# EasyEDA schematic Prática-10.json
TITLE: Sheet_1; REV: 1.0; Date: 2020-11-04; Sheet: 1/1; Company: Your Company
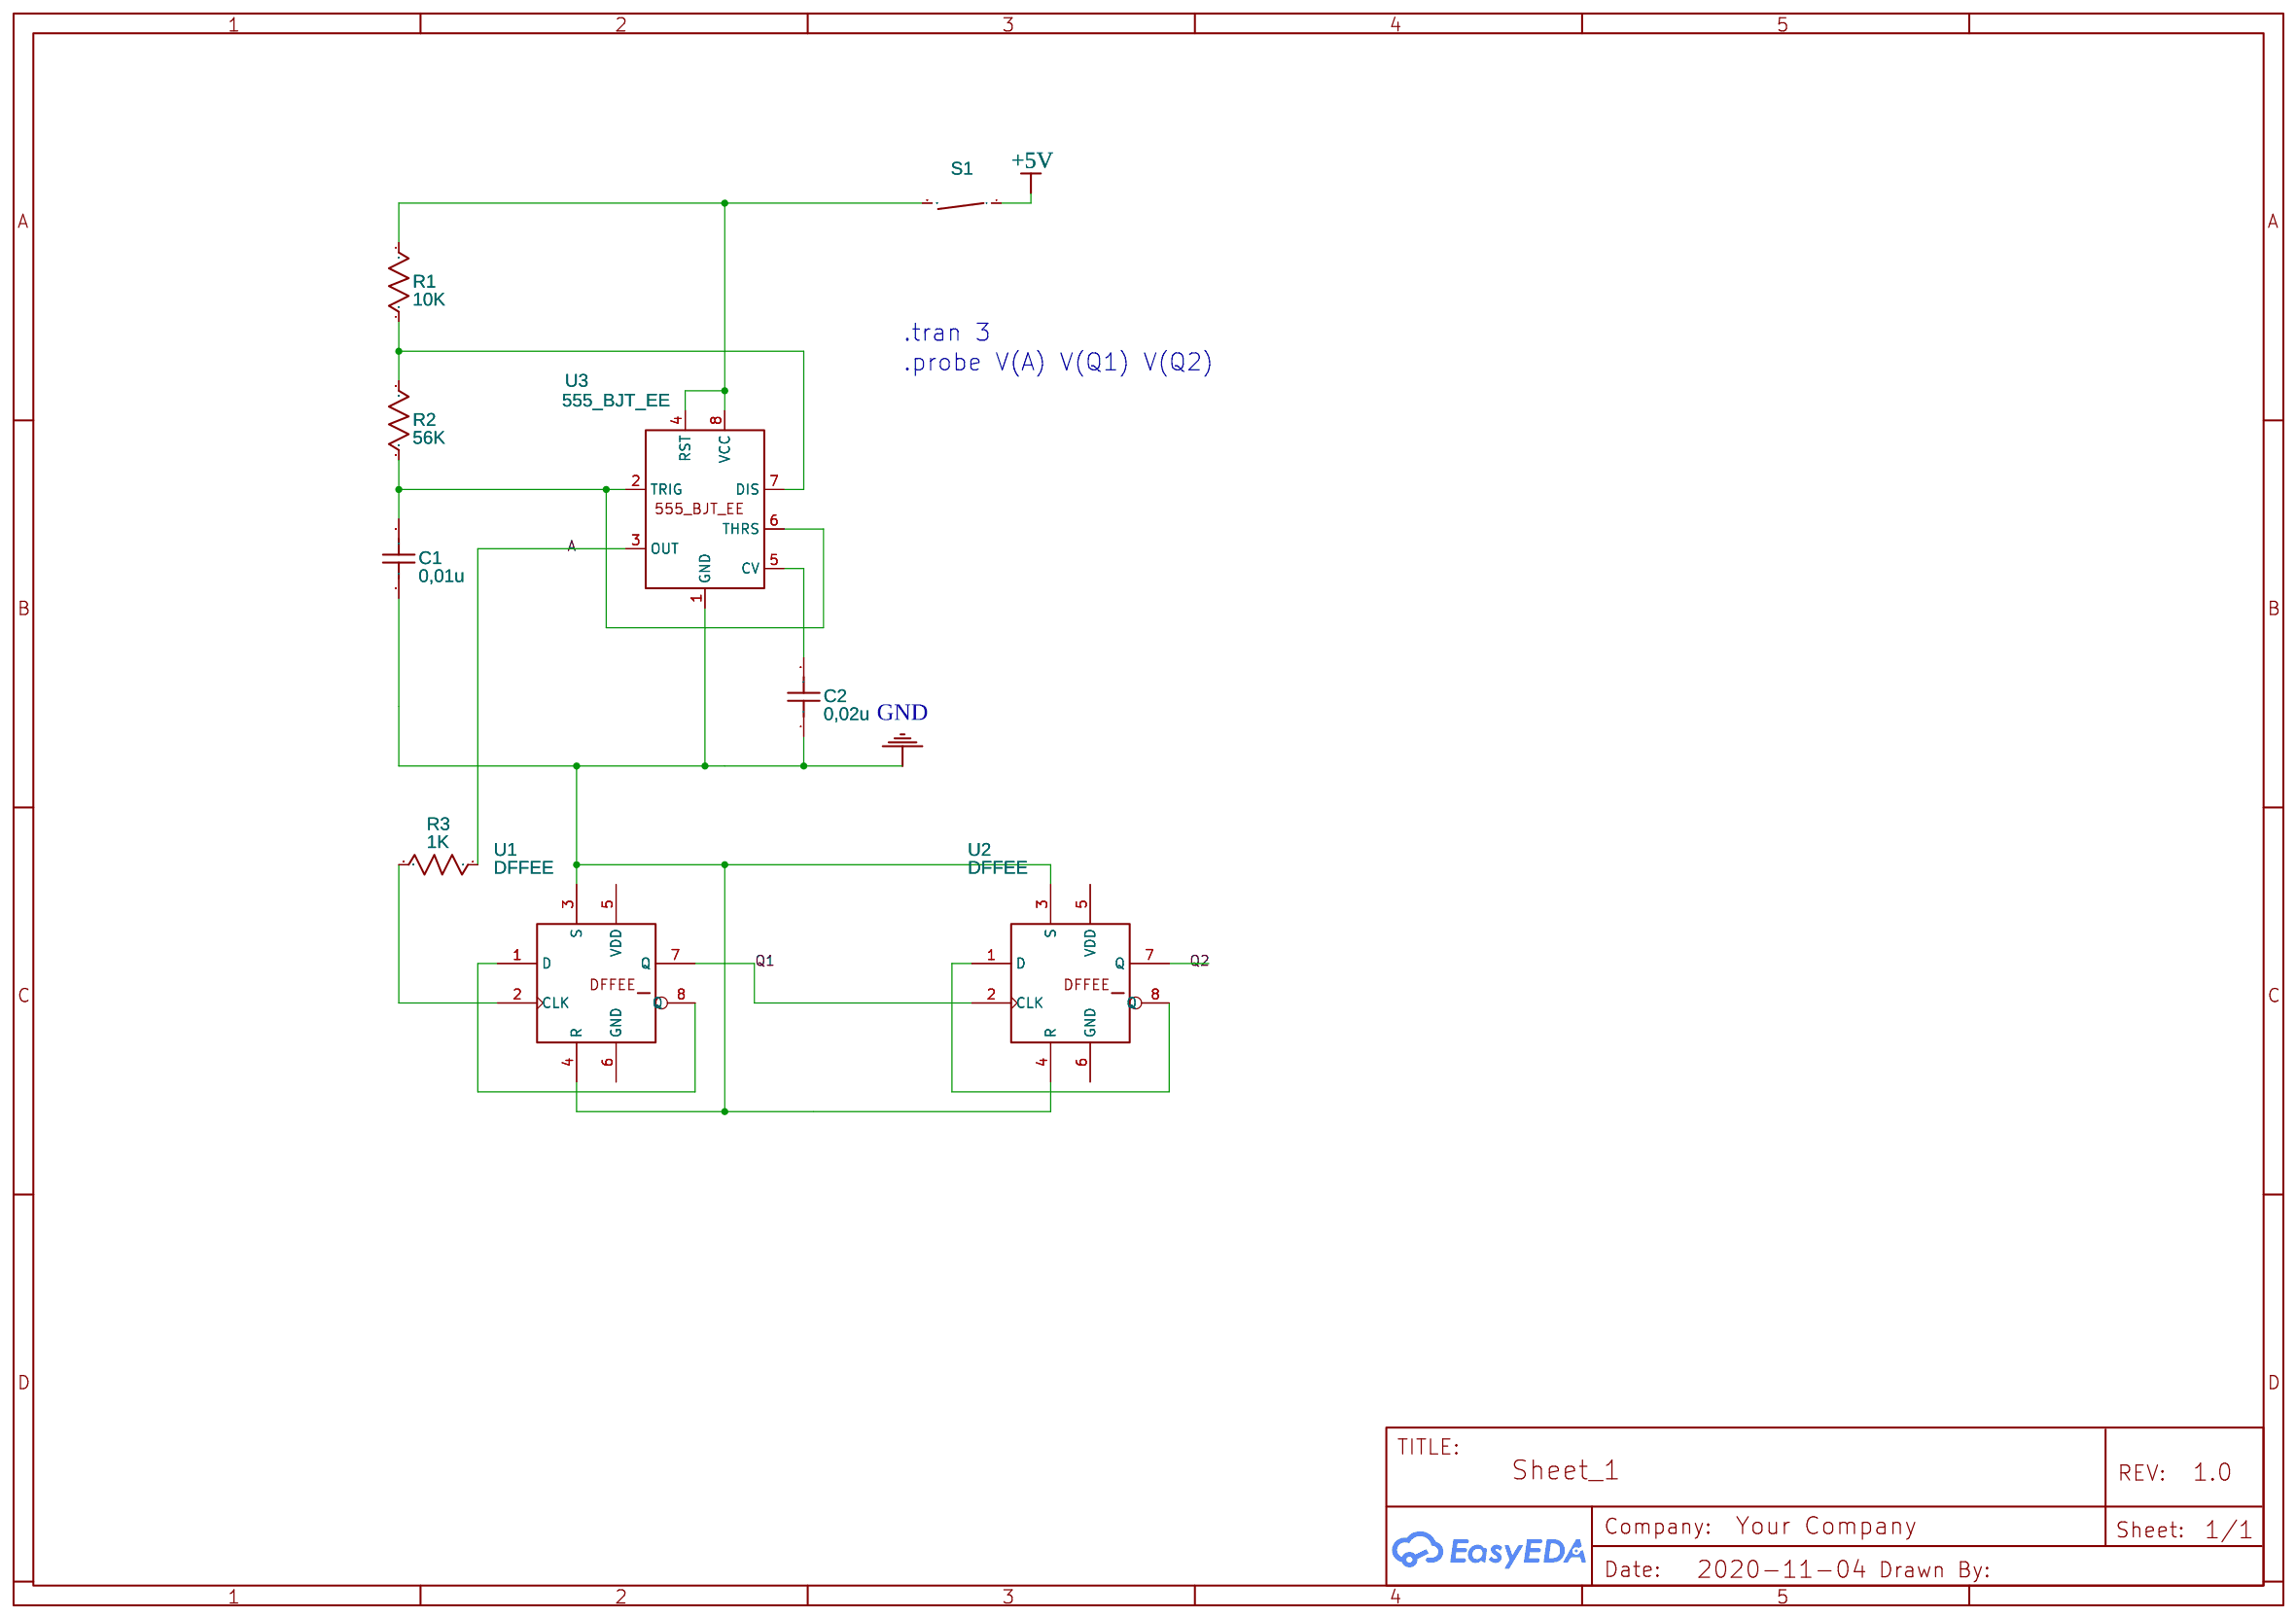
[diagram p0: schematic sheet]

## Parts
C1  0,01u  [RAD-0.1]
C2  0,02u  [RAD-0.1]
R1  10K  [AXIAL-0.3]
R2  56K  [AXIAL-0.3]
R3  1K  [AXIAL-0.3]
S1  SPST_Open
U1  DFFEE
U2  DFFEE
U3  555_BJT_EE  [DIP8]

## Library data of the parts
C1 C2 = Capacitor_US: Contributor: EasyEDA; Supplier: YUJING; Capacitance: 1u
R1-R3 = Resistor_US: Resistance: 1k; Contributor: EasyEDA; Supplier: YUJING
S1 = SPST: catid: 20; State: Close; Contributor: EasyEDA; NameDisplay: 0
U1 U2 = LOGIC: Contributor: EasyEDA; Supplier: YUJING
U3 = 555_BJT_EE: Contributor: EasyEDA; link: http://www.ti.com/lit/ds/symlink/ne555.pdf

## Nets
+5V: S1.1
GND: C1.1 C2.1 U1.3(S) U1.4(R) U2.3(S) U2.4(R) U3.1(GND)
A: R3.1 U3.3(OUT)
Q1: U1.7(Q) U2.2(CLK)
Q2: U2.7(Q)
Net-(C1-2): C1.2 R2.1 U3.2(TRIG) U3.6(THRS)
Net-(C2-2): C2.2 U3.5(CV)
Net-(R1-1): R1.1 R2.2 U3.7(DIS)
Net-(R1-2): R1.2 S1.2 U3.4(RST) U3.8(VCC)
Net-(R3-2): R3.2 U1.2(CLK)
Net-(U1-1): U1.1(D) U1.8(Q)
Net-(U2-1): U2.1(D) U2.8(Q)

Not connected (* = marked no-connect by the designer): U1 5(VDD) 6(GND); U2 5(VDD) 6(GND)

## Notes on the sheet
- .tran 3
- .probe V(A) V(Q1) V(Q2)
